# Altium schematic sheet CC2650MCURadio.SchDoc: TI CC2650 Radio and MCU
size A3; Author: Craig Hesling; DrawnBy: Craig Hesling; Revision: 2
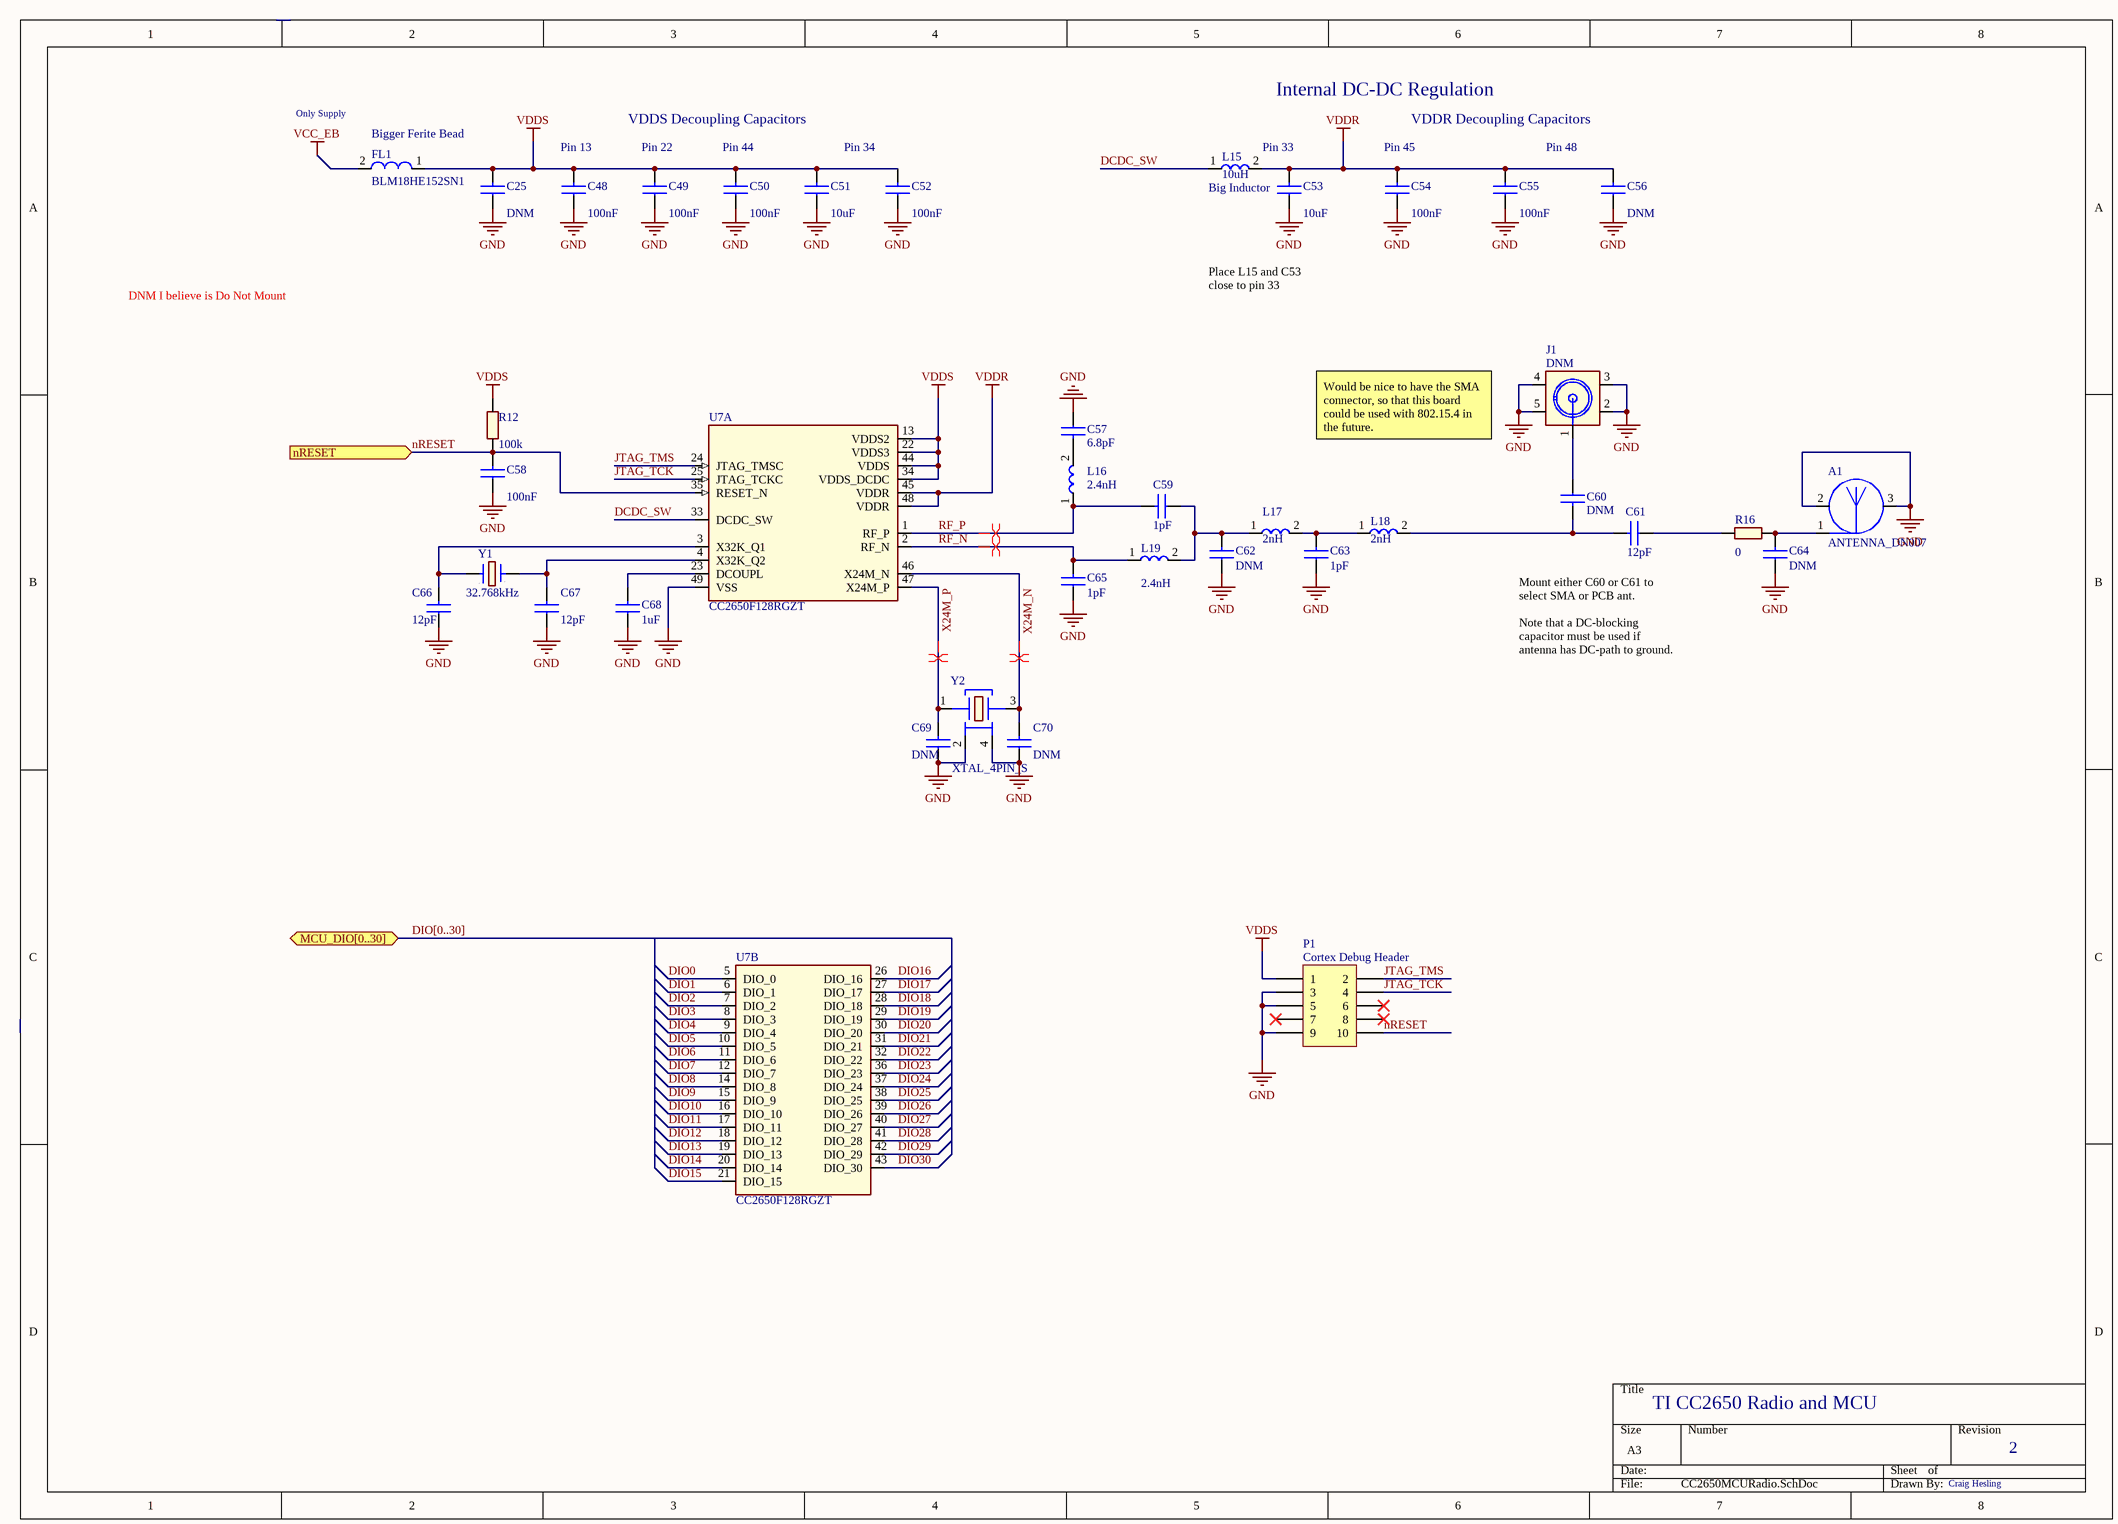
[diagram p0: CC2650MCURadio.SchDoc]

## Parts
A1  ANTENNA_DN007  [ANTENNA_DN007AN_NO_MASK]
C25  value DNM  [CAPC0402(1005)60_N]  (hidden comment: CAPACITOR)
C48  value 100nF  [CAPC0402(1005)60_N]  (hidden comment: CAPACITOR)
C49  value 100nF  [CAPC0402(1005)60_N]  (hidden comment: CAPACITOR)
C50  value 100nF  [CAPC0402(1005)60_N]  (hidden comment: CAPACITOR)
C51  value 10uF  [CAPC0603(1608)100_N]  (hidden comment: CAPACITOR)
C52  value 100nF  [CAPC0603(1608)100_N]  (hidden comment: CAPACITOR)
C53  value 10uF  [CAPC0603(1608)100_N]  (hidden comment: CAPACITOR)
C54  value 100nF  [CAPC0402(1005)60_N]  (hidden comment: CAPACITOR)
C55  value 100nF  [CAPC0402(1005)60_N]  (hidden comment: CAPACITOR)
C56  value DNM  [CAPC0402(1005)60_N]  (hidden comment: CAPACITOR)
C57  value 6.8pF  [CAPC0402(1005)60_N]  (hidden comment: CAPACITOR)
C58  value 100nF  [CAPC0402(1005)60_N]  (hidden comment: CAPACITOR)
C59  value 1pF  [CAPC0402(1005)60_N]  (hidden comment: CAPACITOR)
C60  value DNM  [CAPC0402(1005)60_N]  (hidden comment: CAPACITOR)
C61  value 12pF  [CAPC0402(1005)60_N]  (hidden comment: CAPACITOR)
C62  value DNM  [CAPC0402(1005)60_N]  (hidden comment: CAPACITOR)
C63  value 1pF  [CAPC0402(1005)60_N]  (hidden comment: CAPACITOR)
C64  value DNM  [CAPC0402(1005)60_N]  (hidden comment: CAPACITOR)
C65  value 1pF  [CAPC0402(1005)60_N]  (hidden comment: CAPACITOR)
C66  value 12pF  [CAPC0402(1005)60_N]  (hidden comment: CAPACITOR)
C67  value 12pF  [CAPC0402(1005)60_N]  (hidden comment: CAPACITOR)
C68  value 1uF  [CAPC0402(1005)60_N]  (hidden comment: CAPACITOR)
C69  value DNM  [CAPC0402(1005)60_N]  (hidden comment: CAPACITOR)
C70  value DNM  [CAPC0402(1005)60_N]  (hidden comment: CAPACITOR)
FL1  BLM18HE152SN1  [FIL_BLM18HE152SN1DL]
J1  DNM  [HUSTSAN_SMA10V21TGGAN_POLYGONPOUR_CUTOUT]
L15  value 10uH  [CAPC0805(2012)75_N]  (hidden comment: INDUCTOR)
L16  value 2.4nH  [INDC1005X60L]  (hidden comment: INDUCTOR)
L17  value 2nH  [INDC1005X60L]  (hidden comment: INDUCTOR)
L18  value 2nH  [INDC1005X60L]  (hidden comment: INDUCTOR)
L19  value 2.4nH  [INDC1005X60L]  (hidden comment: INDUCTOR)
P1  Cortex Debug Header  [Header 1.27mm 2x5 SMD]
R12  value 100k  [RESC1005X40L]  (hidden comment: RESISTOR)
R16  value 0  [RESC1005X40L]  (hidden comment: RESISTOR)
U7  CC2650F128RGZT  [QFN50P700X700X100_HS-49N]  (parts A,B of 2)
Y1  Frequency: 32.768kHz  [XTAL_FC-135N]  (hidden comment: CRYSTAL)
Y2  XTAL_4PIN_S  [Crystal 4-SMD 5.0x3.2mm]

## Ports
MCU_DIO[0..30] (bidir), nRESET (in)

## Nets
GND: A1.2(GND_2) A1.3(GND_3) C25.1 C48.1 C49.1 C50.1 C51.1 C52.1 C53.1 C54.1 C55.1 C56.1 C57.1 C58.1 C62.1 C63.1 C64.1 C65.1 C66.1 C67.1 C68.1 C69.1 C70.1 J1.2 J1.3 J1.4 J1.5 P1.3 P1.5 P1.9 U7.49(VSS) Y2.2 Y2.4
VCC_EB: FL1.2
VDDR: C53.2 C54.2 C55.2 C56.2 L15.2 U7.45(VDDR) U7.48(VDDR)
VDDS: C25.2 C48.2 C49.2 C50.2 C51.2 C52.2 FL1.1 P1.1 R12.2 U7.13(VDDS2) U7.22(VDDS3) U7.34(VDDS_DCDC) U7.44(VDDS)
DCDC_SW: L15.1 U7.33(DCDC_SW)
DIO0: U7.5(DIO_0)
DIO1: U7.6(DIO_1)
DIO2: U7.7(DIO_2)
DIO3: U7.8(DIO_3)
DIO4: U7.9(DIO_4)
DIO5: U7.10(DIO_5)
DIO6: U7.11(DIO_6)
DIO7: U7.12(DIO_7)
DIO8: U7.14(DIO_8)
DIO9: U7.15(DIO_9)
DIO10: U7.16(DIO_10)
DIO11: U7.17(DIO_11)
DIO12: U7.18(DIO_12)
DIO13: U7.19(DIO_13)
DIO14: U7.20(DIO_14)
DIO15: U7.21(DIO_15)
DIO16: U7.26(DIO_16)
DIO17: U7.27(DIO_17)
DIO18: U7.28(DIO_18)
DIO19: U7.29(DIO_19)
DIO20: U7.30(DIO_20)
DIO21: U7.31(DIO_21)
DIO22: U7.32(DIO_22)
DIO23: U7.36(DIO_23)
DIO24: U7.37(DIO_24)
DIO25: U7.38(DIO_25)
DIO26: U7.39(DIO_26)
DIO27: U7.40(DIO_27)
DIO28: U7.41(DIO_28)
DIO29: U7.42(DIO_29)
DIO30: U7.43(DIO_30)
JTAG_TCK: P1.4 U7.25(JTAG_TCKC)
JTAG_TMS: P1.2 U7.24(JTAG_TMSC)
nRESET: C58.2 P1.10 R12.1 U7.35(RESET_N) ; port nRESET
RF_N: C65.2 L19.1 U7.2(RF_N)
RF_P: C59.2 L16.1 U7.1(RF_P)
X24M_N: C70.2 U7.46(X24M_N) Y2.3
X24M_P: C69.2 U7.47(X24M_P) Y2.1
NetA1_1: A1.1(FEED_1) C64.2 R16.1
NetC57_2: C57.2 L16.2
NetC59_1: C59.1 C62.2 L17.1 L19.2
NetC60_1: C60.1 J1.1
NetC60_2: C60.2 C61.2 L18.2
NetC61_1: C61.1 R16.2
NetC63_2: C63.2 L17.2 L18.1
NetC66_2: C66.2 U7.3(X32K_Q1) Y1.1
NetC67_2: C67.2 U7.4(X32K_Q2) Y1.2
NetC68_2: C68.2 U7.23(DCOUPL)

Not connected (* = marked no-connect by the designer): P1 6* 7* 8*

## Buses and harness runs
bus DIO[0..30] = port MCU_DIO[0..30]

## Layout directives
differential pair: RF_N, RF_P, X24M_N, X24M_P

## Notes on the sheet
- (near FL1) Only Supply
- VDDS Decoupling Capacitors
- Internal DC-DC Regulation
- VDDR Decoupling Capacitors
- Bigger Ferite Bead
- (near C48) Pin 13
- (near C49) Pin 22
- (near C50) Pin 44
- Pin 34
- Big Inductor
- Pin 33
- (near C54) Pin 45
- Pin 48
- DNM I believe is Do Not Mount
- Place L15 and C53 close to pin 33
- Would be nice to have the SMA connector, so that this board could be used with 802.15.4 in the future.
- (near C61) Mount either C60 or C61 to select SMA or PCB ant.
  Note that a DC-blocking capacitor must be used if antenna has DC-path to ground.

## Library data of the parts
A1 = ANTENNA_DN007: Designed by: Artur Bielinski; Design date: 2011-09-19
C25 C48-C70 = CAPACITOR: TC2: 0; MAX_TEMP: CTMAX; SLOPE: CSMAX; DIST: FLAT; PSpiceTemplate: C^@REFDES %1 %2 ?TOLERANCE|C^@REFDES| @VALUE ?IC/IC=@IC/ TC=@TC1,@TC2 ?TOLERANCE|\n.model C^@REFDES CAP C=1 DEV=@TOLERANCE%|; KNEE: CBMAX; CURRENT: CIMAX; VOLTAGE: CMAX; TC1: 0
FL1 = FILTER_2PIN
J1 = CONN_COAX_1+4
L15-L19 = INDUCTOR: DIST: FLAT; DIELECTRIC: DSMAX; PSpiceTemplate: L^@REFDES %1 %2 ?TOLERANCE|L^@REFDES| @VALUE ?IC/IC=@IC/ ?TOLERANCE|\n.model l^@REFDES IND L=1 DEV=@TOLERANCE%|; Current: LMAX
P1 = Header 5X2: Header, 5-Pin, Dual row, Right Angle; LatestRevisionDate: 17-Jul-2002; LatestRevisionNote: Re-released for DXP Platform.; Publisher: Altium Limited; Supplier 1: Digi-Key; Supplier 2: Newark; Supplier 3: Allied; Supplier 4: Mouser; Supplier 5: Arrow; Supplier Part Number 1: 609-3695-1-ND; Supplier Part Number 2: 58R3188; Supplier Part Number 3: 70247660; Supplier Part Number 4: 649-202112100010C4LF; Supplier Part Number 5: XRQSqUttyxup-fqyNuPGZKBQalM97QjttTt_8zN-BzU
R12 = RESISTOR: PSpiceTemplate: R^@REFDES %1 %2 ?TOLERANCE|R^@REFDES| @VALUE TC=@TC1,@TC2 ?TOLERANCE|\n.model R^@REFDES RES R=1 DEV=@TOLERANCE%|; VOLTAGE: RVMAX; DIST: FLAT; MAX_TEMP: RTMAX; TC1: 0; POWER: RMAX; TC2: 0
R16 = RESISTOR: PSpiceTemplate: R^@REFDES %1 %2 ?TOLERANCE|R^@REFDES| @VALUE TC=@TC1,@TC2 ?TOLERANCE|\n.model R^@REFDES RES R=1 DEV=@TOLERANCE%|; VOLTAGE: RVMAX; DIST: FLAT; MAX_TEMP: RTMAX; POWER: RMAX; TC1: 0; TC2: 0
U7 = CC2650F128RGZT: Designed_By: Artur Bielinski; SPLIT_INST: TRUE; SWAP_INFO: (S1+S2); Design_Date: 2013-02-14; PartNumber: CC2650F128RGZT; Supplier 1: Mouser; Supplier 2: Newark; Supplier 3: Arrow; Supplier 4: Digi-Key; Supplier Part Number 1: 595-CC2650F128RGZR; Supplier Part Number 2: 51Y5273; Supplier Part Number 3: tP0-S_ikkGau3GntdWAPvj-z4JJMLRcy006RExL3IaQ; Supplier Part Number 4: 296-39656-1-ND